# Altium schematic sheet 15 USB.SchDoc
size B; DocumentNumber: 15; SheetNumber: 15; SheetTotal: 17
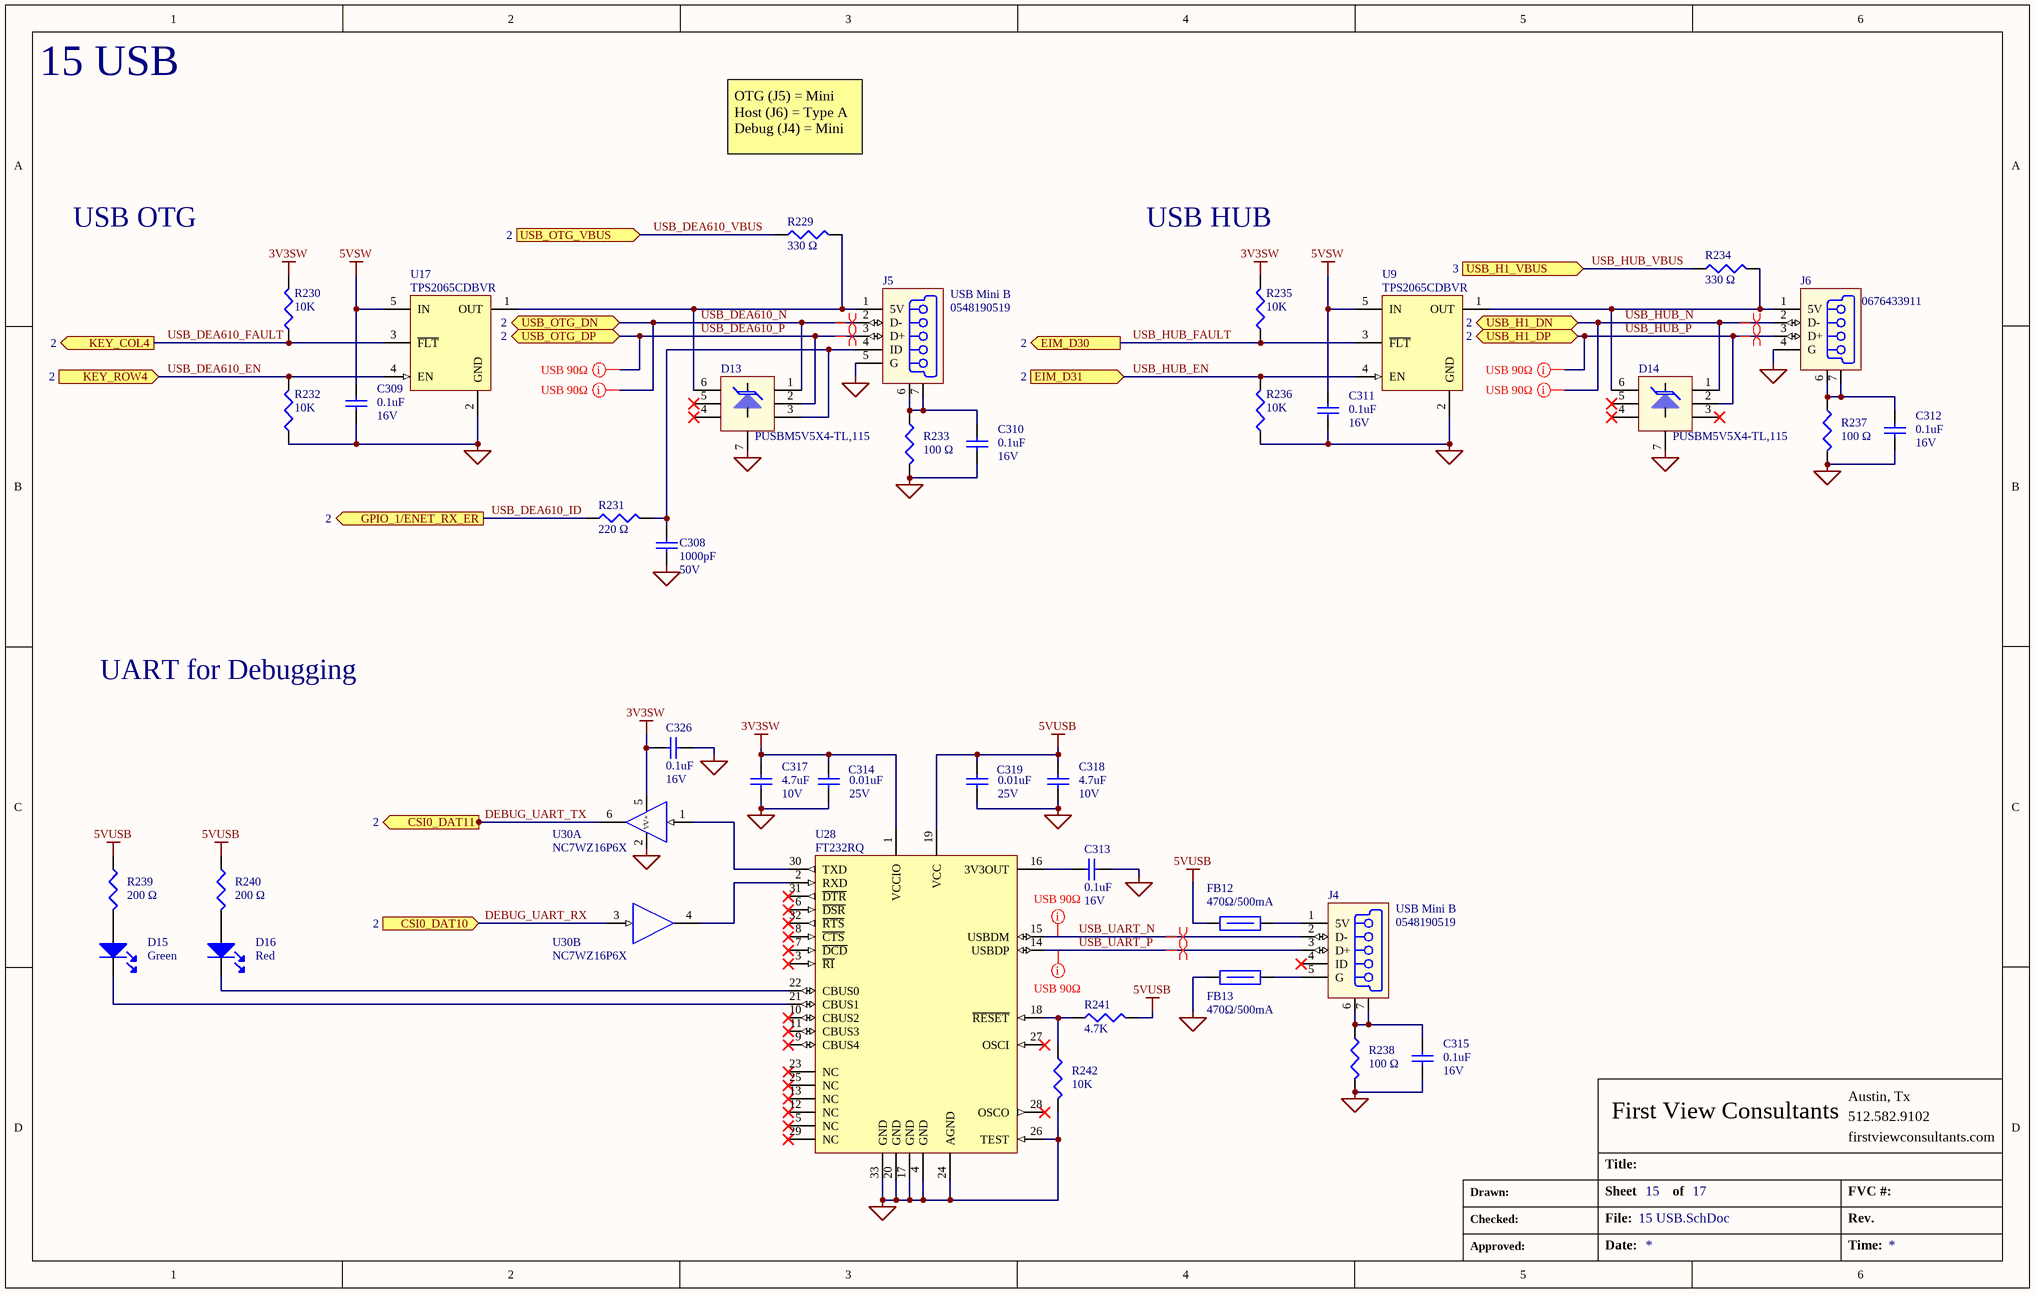
[diagram p0: 15 USB.SchDoc]

## Parts
C308  value 1000pF  Voltage: 50V  [CAP_0402]  (hidden comment: Cap 1000pF 50V 0402)
C309  value 0.1uF  Voltage: 16V  [CAP_0402]  (hidden comment: Cap 0.1uF 16V 0402)
C310  value 0.1uF  Voltage: 16V  [CAP_0402]  (hidden comment: Cap 0.1uF 16V 0402)
C311  value 0.1uF  Voltage: 16V  [CAP_0402]  (hidden comment: Cap 0.1uF 16V 0402)
C312  value 0.1uF  Voltage: 16V  [CAP_0402]  (hidden comment: Cap 0.1uF 16V 0402)
C313  value 0.1uF  Voltage: 16V  [CAP_0402]  (hidden comment: Cap 0.1uF 16V 0402)
C314  value 0.01uF  Voltage: 25V  [CAP_0402]  (hidden comment: Cap 0.01uF 50V 0402)
C315  value 0.1uF  Voltage: 16V  [CAP_0402]  (hidden comment: Cap 0.1uF 16V 0402)
C317  value 4.7uF  Voltage: 10V  [CAP_0402]  (hidden comment: Cap 4.7uF 10V 0603)
C318  value 4.7uF  Voltage: 10V  [CAP_0402]  (hidden comment: Cap 4.7uF 10V 0603)
C319  value 0.01uF  Voltage: 25V  [CAP_0402]  (hidden comment: Cap 0.01uF 50V 0402)
C326  value 0.1uF  Voltage: 16V  [CAP_0402]  (hidden comment: Cap 0.1uF 16V 0402)
D13  PUSBM5V5X4-TL,115  [DFN_PUSBM5V5X4-TL,115]
D14  PUSBM5V5X4-TL,115  [DFN_PUSBM5V5X4-TL,115]
D15  value Green  [LED_0603]  (hidden comment: LG L29K-G2J1-24-Z)
D16  value Red  [LED_0603]  (hidden comment: LTST-C191KRKT)
FB12  value 470Ω/500mA  [IND_0603]  (hidden comment: BLM18EG471SN1D)
FB13  value 470Ω/500mA  [IND_0603]  (hidden comment: BLM18EG471SN1D)
J4  0548190519  value USB Mini B  [CON_USB_0548190519]
J5  0548190519  value USB Mini B  [CON_USB_0548190519]
J6  0676433911  [CON_USB-0676433911]
R229  value 330 Ω  [RES_0402]  (hidden comment: Res 330R 0.063W)
R230  value 10K  [RES_0402]  (hidden comment: Res 10K 0.063W)
R231  value 220 Ω  [RES_0402]  (hidden comment: Res 220R 0.063W)
R232  value 10K  [RES_0402]  (hidden comment: Res 10K 0.063W)
R233  value 100 Ω  [RES_0402]  (hidden comment: Res 100R 0.063W)
R234  value 330 Ω  [RES_0402]  (hidden comment: Res 330R 0.063W)
R235  value 10K  [RES_0402]  (hidden comment: Res 10K 0.063W)
R236  value 10K  [RES_0402]  (hidden comment: Res 10K 0.063W)
R237  value 100 Ω  [RES_0402]  (hidden comment: Res 100R 0.063W)
R238  value 100 Ω  [RES_0402]  (hidden comment: Res 100R 0.063W)
R239  value 200 Ω  [RES_0402]  (hidden comment: Res 200R 0.063W)
R240  value 200 Ω  [RES_0402]  (hidden comment: Res 200R 0.063W)
R241  value 4.7K  [RES_0402]  (hidden comment: Res 4.7K 0.063W)
R242  value 10K  [RES_0402]  (hidden comment: Res 10K 0.063W)
U9  TPS2065CDBVR  [SOT-23-5_TPS2065CDBVR]
U17  TPS2065CDBVR  [SOT-23-5_TPS2065CDBVR]
U28  FT232RQ  [VFQFN-32_FT232RQ]
U30  NC7WZ16P6X  [SOT-363_NC7WZ16P6X]  (parts A,B of 2)

## Ports
CSI0_DAT10 (in, see 2), CSI0_DAT11 (out, see 2), EIM_D30 (out, see 2), EIM_D31 (in, see 2), GPIO_1/ENET_RX_ER (out, see 2), KEY_COL4 (out, see 2), KEY_ROW4 (in, see 2), USB_H1_DN (bidir, see 2), USB_H1_DP (bidir, see 2), USB_H1_VBUS (in, see 3), USB_OTG_DN (bidir, see 2), USB_OTG_DP (bidir, see 2), USB_OTG_VBUS (in, see 2)

## Nets
3V3SW: C314.1 C317.1 C326.1 R230.1 R235.1 U28.1(VCCIO) U30.5(V+)
5VSW: C309.1 C311.1 U9.5(IN) U17.5(IN)
5VUSB: C318.1 C319.1 FB12.1 R239.1 R240.1 R241.2 U28.19(VCC)
GND: C308.2 C309.2 C310.2 C311.2 C312.2 C313.2 C314.2 C315.2 C317.2 C318.2 C319.2 C326.2 D13.7 D14.7 FB13.1 J5.5(G) J6.4(G) R232.2 R233.2 R236.2 R237.2 R238.2 R242.2 U9.2(GND) U17.2(GND) U28.4(GND) U28.17(GND) U28.20(GND) U28.24(AGND) U28.26(TEST) U28.33(GND) U30.2(V-)
DEBUG_UART_RX: U30.3(A2) ; port CSI0_DAT10
DEBUG_UART_TX: U30.6(Y1) ; port CSI0_DAT11
USB_DEA610_EN: R232.1 U17.4(EN) ; port KEY_ROW4
USB_DEA610_FAULT: R230.2 U17.3(~{FLT}) ; port KEY_COL4
USB_DEA610_ID: R231.1 ; port GPIO_1/ENET_RX_ER
USB_DEA610_N: D13.1 J5.2(D-) ; port USB_OTG_DN
USB_DEA610_P: D13.2 J5.3(D+) ; port USB_OTG_DP
USB_DEA610_VBUS: R229.1 ; port USB_OTG_VBUS
USB_HUB_EN: R236.1 U9.4(EN) ; port EIM_D31
USB_HUB_FAULT: R235.2 U9.3(~{FLT}) ; port EIM_D30
USB_HUB_N: D14.1 J6.2(D-) ; port USB_H1_DN
USB_HUB_P: D14.2 J6.3(D+) ; port USB_H1_DP
USB_HUB_VBUS: R234.1 ; port USB_H1_VBUS
USB_UART_N: J4.2(D-) U28.15(USBDM)
USB_UART_P: J4.3(D+) U28.14(USBDP)
NetC308_1: C308.1 D13.3 J5.4(ID) R231.2
NetC310_1: C310.1 J5.6(S1) J5.7(S2) R233.1
NetC312_1: C312.1 J6.6(S1) J6.7(S2) R237.1
NetC313_1: C313.1 U28.16(3V3OUT)
NetC315_1: C315.1 J4.6(S1) J4.7(S2) R238.1
NetD13_6: D13.6 J5.1(5V) R229.2 U17.1(OUT)
NetD14_6: D14.6 J6.1(5V) R234.2 U9.1(OUT)
NetD15_A: D15.A R239.2
NetD15_K: D15.K U28.21(CBUS1)
NetD16_A: D16.A R240.2
NetD16_K: D16.K U28.22(CBUS0)
NetFB12_2: FB12.2 J4.1(5V)
NetFB13_2: FB13.2 J4.5(G)
NetR241_1: R241.1 R242.1 U28.18(~{RESET})
NetU28_2: U28.2(RXD) U30.4(Y2)
NetU28_30: U28.30(TXD) U30.1(A1)

Not connected (* = marked no-connect by the designer): D13 4* 5*; D14 3* 4* 5*; J4 4(ID)*; U28 3(~{RI})* 5(NC)* 6(~{DSR})* 7(~{DCD})* 8(~{CTS})* 9(CBUS4)* 10(CBUS2)* 11(CBUS3)* 12(NC)* 13(NC)* 23(NC)* 25(NC)* 27(OSCI)* 28(OSCO)* 29(NC)* 31(~{DTR})* 32(~{RTS})*

## Layout directives
net class USB 90ohm; Impedance: 90 Ω: USB_DEA610_N, USB_DEA610_P, USB_HUB_N, USB_HUB_P, USB_UART_N, USB_UART_P
differential pair: USB_DEA610_N, USB_DEA610_P, USB_HUB_N, USB_HUB_P, USB_UART_N, USB_UART_P

## Notes on the sheet
- 15 USB
- OTG (J5) = Mini
  Host (J6) = Type A
  Debug (J4) = Mini
- USB OTG
- USB HUB
- UART for Debugging
- Austin, Tx
- Title:
- First View Consultants
- 512.582.9102
- firstviewconsultants.com
- Drawn:
- Checked:
- File:
- Sheet
- of
- FVC #:
- Rev.
- Approved:
- Date:
- Time:

## Library data of the parts
C308 = Cap 1000pF 50V 0402: Cap, Cer, 1000pF, 50V, 20%, X7R, 0402; Manufacturer: Murata Electronics North America; Manufacturer #: GRM155R71H102KA01D; Have Footprint: yes; Tolerance: 20%; PACKAGE: 0402
C309-C313 C315 C326 = Cap 0.1uF 16V 0402: Cap, Cer, 0.1uF, 16V, 10%, X7R, 0402; Manufacturer #: GRM155R71C104KA88D; Manufacturer: Murata Electronics North America; Have Footprint: yes; Package: 0402; Tolerance: ±10%
C314 C319 = Cap 0.01uF 50V 0402: Cap, Cer, 0.01uF, 25V, ±10%, X7R, 0402; Manufacturer #: GRM155R71E103KA01J; Manufacturer: Murata; Have Footprint: yes; Tolerance: ±10%; Package: 0402
C317 C318 = Cap 4.7uF 10V 0603: Cap, Cer, 4.7uF, 10V, 10%, X5R, 0603; Manufacturer #: LMK107BJ475KA-T; Manufacturer: Taiyo Yuden; Have Footprint: yes; Tolerance: ±10%; Package: 0402
D13 D14 = PUSBM5V5X4-TL,115: Diode, TVS, USB 2.0 & OTG, DFN-6; Manufacturer: NXP Semiconductors; Package: DFN (1.6x1.6); Manufacturer #: PUSBM5V5X4-TL,115
D15 = LG L29K-G2J1-24-Z: Led, Green, 2mA, 1.7V, 0603; Manufacturer: OSRAM Opto Semiconductors Inc; Have Footprint: yes; RoHS: yes; Operating Temperature: -40°C ~ 125°C; Package: 0603; Manufacturer #: LG L29K-G2J1-24-Z
D16 = LTST-C191KRKT: Led, Red, 20mA, 2V, 0603; Manufacturer: Lite-On Inc; Have Footprint: yes; RoHS: yes; Package: 0603; Manufacturer #: LTST-C191KRKT
FB12 FB13 = BLM18EG471SN1D: Ind, Ferrite Bead, 470R, 210mOhm, 0.5A, 0603; Manufacturer: Murata Electronics North America; Have Footprint: yes; Manufacturer #: BLM18EG471SN1D; Cost: 0.23; Package: 0603
J4 J5 = 0548190519: Conn, USB, Mini B, 5 Pos, R/A, TH; Manufacturer: Molex Inc; Manufacturer #: 0548190519
J6 = 0676433911: Conn, USB, Type A, 4 Pos, R/A, TH; Manufacturer: Molex Inc; Manufacturer #: 0676433911
R229 R234 = Res 330R 0.063W: Res, 330R, 0.063W, 1%, 0402; Manufacturer #: RC0402FR-07330RL; Manufacturer: Yageo; Have Footprint: yes; Package: 0402; Cost: *
R230 R232 R235 R236 R242 = Res 10K 0.063W: Res, 10K, 1/16W, 1%, 0402; Manufacturer #: RC0402FR-0710KL; Manufacturer: Yageo; Have Footprint: yes; Package: 0402
R231 = Res 220R 0.063W: Res, 220R, 0.063W, 5%, 0402; Manufacturer #: RMCF0402JT220R; Manufacturer: Stackpole Electronics Inc; Have Footprint: yes; Package: 0402
R233 R237 R238 = Res 100R 0.063W: Res, 100R, 0.063W, 1%, 0402; Manufacturer #: TRR01MZPF1000; Manufacturer: Murata Electronics North America; Have Footprint: yes; Package: 0402
R239 R240 = Res 200R 0.063W: Res, 200R, 0.063W, 1%, 0402; Manufacturer #: RC0402FR-07200RL; Manufacturer: Yageo; Have Footprint: yes; Package: 0402
R241 = Res 4.7K 0.063W: Res, 4.70K, 0.063W, 1%, 0402; Manufacturer #: CRCW04024K70FKED; Manufacturer: Vishay Dale; Have Footprint: yes; Package: 0402
U9 U17 = TPS2065CDBVR: IC, Power Switch, USB, 1.48A, SOT-23-5; Manufacturer: Texas Instruments; θJA: 224.9; Have Footprint: yes; Package: SOT-23-5; Operating Temperature: -40°C ~ 85°C; RoHS: yes; Manufacturer #: TPS2065CDBVR
U28 = FT232RQ: IC, USB to UART, 3.3-5.25V, QFN-32; Manufacturer #: FT232RQ-REEL; Manufacturer: FTDI; Have Footprint: yes
U30 = NC7WZ16P6X: IC, Buffer, 1.65-5.5V, -40+125°C, SOT-363; Manufacturer: Fairchild Semiconductor; Have Footprint: yes; Cost: 0.45; Package: SOT-363; Manufacturer #: NC7WZ16P6X